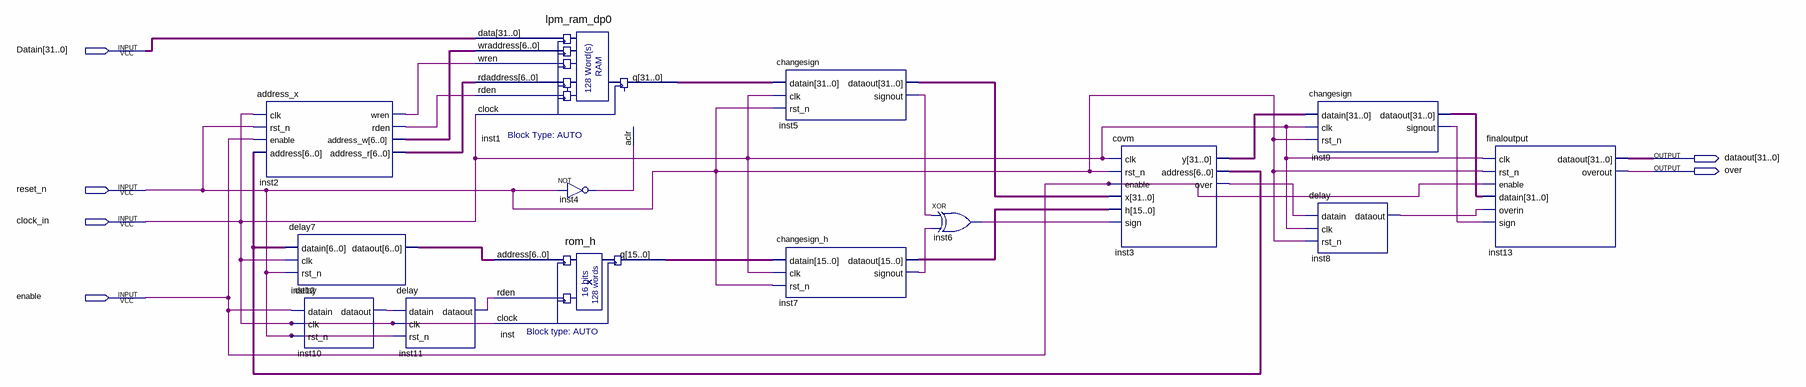
[diagram p0: schematic sheet]
// Quartus schematic Filter.bdf as structural Verilog: 14 symbols, 6 pins
module Filter (
  input  [31:0] Datain,
  input  reset_n,
  input  clock_in,
  input  enable,
  output [31:0] dataout,
  output over
);

  wire inst2_rden, inst2_wren, inst3_over, inst4_out, inst5_signout, inst6_out, inst7_signout, inst8_dataout,
       inst9_signout, inst10_dataout, inst11_dataout;
  wire [6:0] inst2_address_r, inst2_address_w, inst3_address, inst12_dataout;
  wire [15:0] inst7_dataout, inst_q;
  wire [31:0] inst1_q, inst3_y, inst5_dataout, inst9_dataout;

  address_x inst2 (
    .clk(clock_in), .rst_n(reset_n), .enable(enable), .address(inst3_address), .wren(inst2_wren),
    .rden(inst2_rden), .address_w(inst2_address_w), .address_r(inst2_address_r));
  delay7 inst12 (.datain(inst3_address), .clk(clock_in), .rst_n(reset_n), .dataout(inst12_dataout));
  delay inst10 (.datain(enable), .clk(clock_in), .rst_n(reset_n), .dataout(inst10_dataout));
  delay inst11 (.datain(inst10_dataout), .clk(clock_in), .rst_n(reset_n), .dataout(inst11_dataout));
  lpm_ram_dp0 inst1 (
    .data(Datain), .wraddress(inst2_address_w), .wren(inst2_wren), .rdaddress(inst2_address_r),
    .rden(inst2_rden), .clock(clock_in), .aclr(inst4_out), .q(inst1_q));
  rom_h inst (.address(inst12_dataout), .rden(inst11_dataout), .clock(clock_in), .q(inst_q));
  not inst4 (inst4_out, reset_n);
  changesign inst5 (
    .datain(inst1_q), .clk(clock_in), .rst_n(reset_n), .dataout(inst5_dataout), .signout(inst5_signout));
  changesign_h inst7 (
    .datain(inst_q), .clk(clock_in), .rst_n(reset_n), .dataout(inst7_dataout), .signout(inst7_signout));
  xor inst6 (inst6_out, inst5_signout, inst7_signout);
  covm inst3 (
    .clk(clock_in), .rst_n(reset_n), .enable(enable), .x(inst5_dataout), .h(inst7_dataout), .sign(inst6_out),
    .y(inst3_y), .address(inst3_address), .over(inst3_over));
  changesign inst9 (
    .datain(inst3_y), .clk(clock_in), .rst_n(reset_n), .dataout(inst9_dataout), .signout(inst9_signout));
  delay inst8 (.datain(inst3_over), .clk(clock_in), .rst_n(reset_n), .dataout(inst8_dataout));
  finaloutput inst13 (
    .clk(clock_in), .rst_n(reset_n), .enable(enable), .datain(inst9_dataout), .overin(inst8_dataout),
    .sign(inst9_signout), .dataout(dataout), .overout(over));
endmodule
